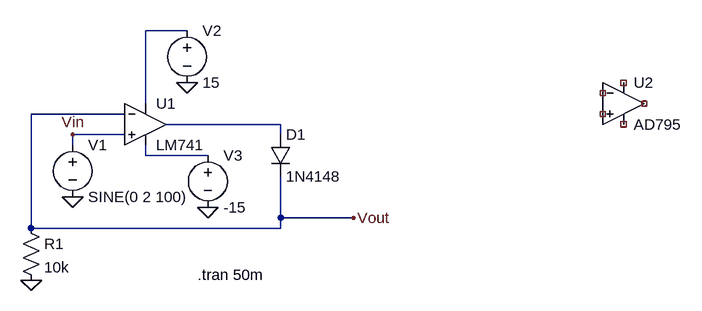
[diagram p0: schematic Rectifier circuit'.asc]
Rectifier circuit'.asc, the LTspice schematic file:
Version 4.1
SHEET 1 1024 680
WIRE 256 16 192 16
WIRE 192 128 192 16
WIRE 160 144 16 144
WIRE 400 160 224 160
WIRE 160 176 80 176
WIRE 400 176 400 160
WIRE 80 192 80 176
WIRE 192 208 192 192
WIRE 288 208 192 208
WIRE 400 304 400 240
WIRE 512 304 400 304
WIRE 16 320 16 144
WIRE 400 320 400 304
WIRE 400 320 16 320
FLAG 80 272 0
FLAG 16 400 0
FLAG 80 176 Vin
FLAG 256 96 0
FLAG 288 288 0
FLAG 512 304 Vout
SYMBOL diode 384 176 R0
SYMATTR InstName D1
SYMATTR Value 1N4148
SYMBOL res 0 304 R0
SYMATTR InstName R1
SYMATTR Value 10k
SYMBOL voltage 80 176 R0
WINDOW 123 0 0 Left 0
WINDOW 39 0 0 Left 0
SYMATTR InstName V1
SYMATTR Value SINE(0 2 100)
SYMBOL voltage 256 0 R0
WINDOW 123 0 0 Left 0
WINDOW 39 0 0 Left 0
SYMATTR InstName V2
SYMATTR Value 15
SYMBOL voltage 288 192 R0
WINDOW 123 0 0 Left 0
WINDOW 39 0 0 Left 0
SYMATTR InstName V3
SYMATTR Value -15
SYMBOL OpAmps\\AD795 928 64 R0
SYMATTR InstName U2
SYMBOL LM741 192 96 R0
SYMATTR InstName U1
TEXT 272 392 Left 2 !.tran 50m

The netlist it stands for:
* Rectifier circuit'.asc
D1 N002 Vout 1N4148
R1 Vout 0 10k
V1 Vin 0 SINE(0 2 100)
V2 N001 0 15
V3 N003 0 -15
X§U2 NC_01 NC_02 NC_03 NC_04 NC_05 AD795  ; pins In+ In- V+ V- OUT
X§U1 Vin Vout N001 N003 N002 LM741  ; pins In+ In- V+ V- OUT
.model D D
.lib standard.dio
.tran 50m
.lib ADI1.lib
.lib LM741.lib
.backanno
.end

* Results of the author's LTspice run, read from the files saved beside the schematic
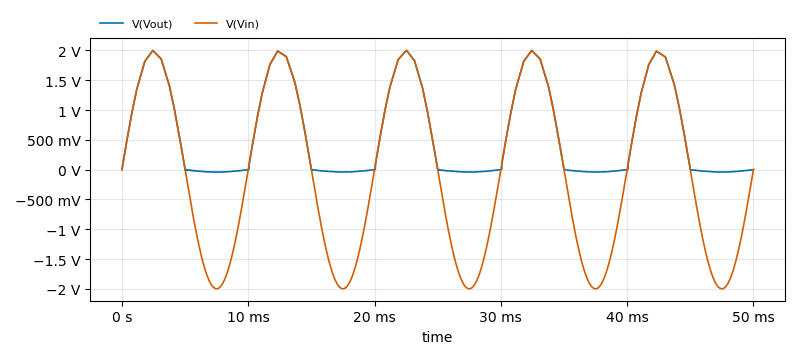
[diagram p1: Transient Analysis of Rectifier circuit'.asc, plotted from the saved traces]
* Transient Analysis, 1 run:
*   V(Vout): min -42.1 mV, max 2.001 V, average 616.2 mV, rms 993.4 mV, last -824.4 µV
*   V(Vin): min -2 V, max 2 V, average -7.241 mV, rms 1.409 V, last 0 V